# EAGLE schematic GPS_radiologger_v2_energy_harvesting (EAGLE 9.5.1)
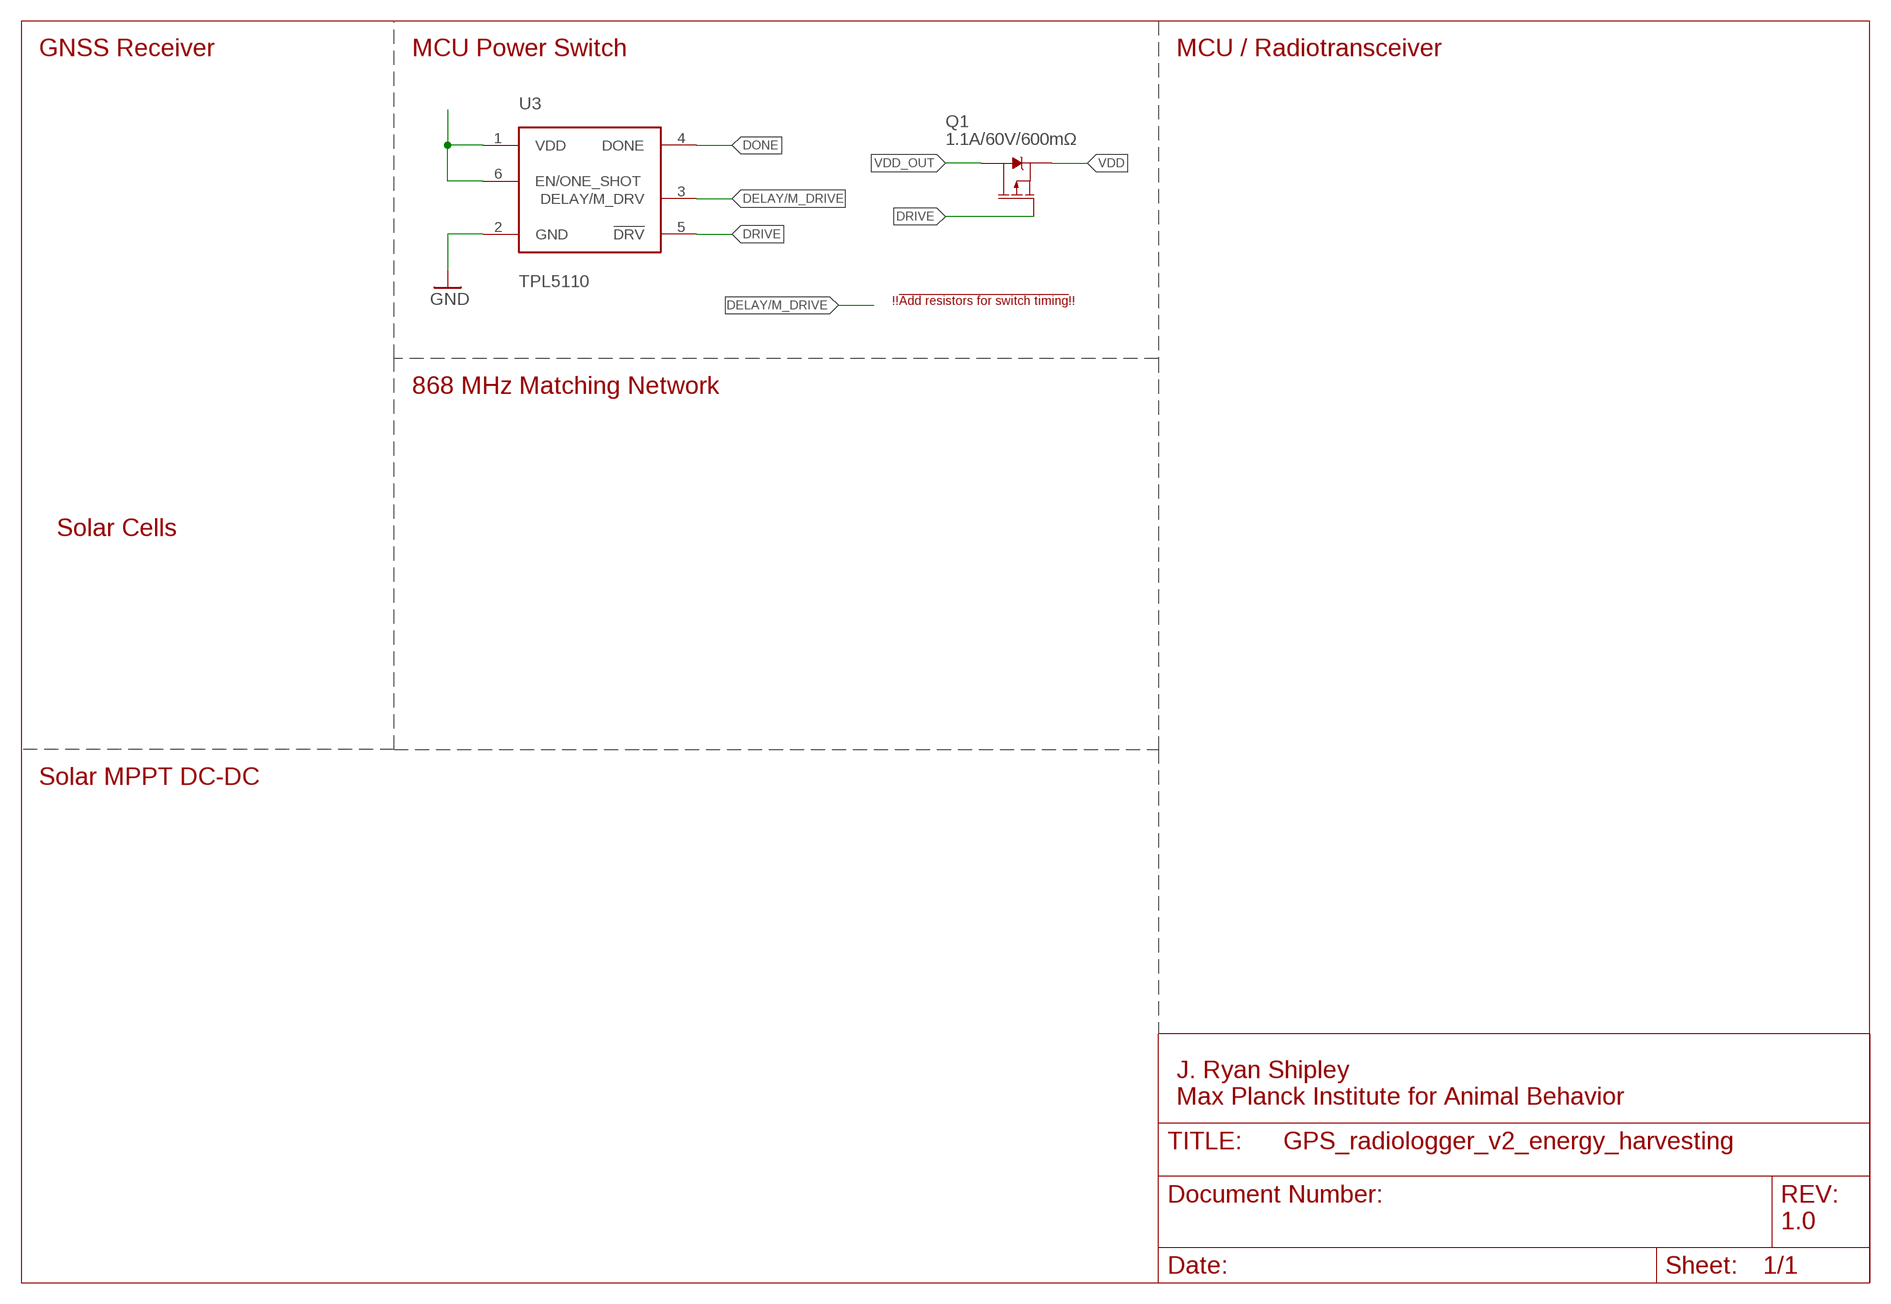
[diagram p0: schematic, sheet 1]

## Parts
Q1  1.1A/60V/600mΩ  MOSFET_PCH-SI2309DS  [SOT23-3]
U3  TPL5110  [SOT23-6]

## Nets
DELAY/M_DRIVE: U3.3(DELAY/M_DRV)
DONE: U3.4(DONE)
DRIVE: Q1.1(G) U3.5(!DRV)
GND: U3.2(GND)
N$6: U3.1(VDD) U3.6(EN/ONE_SHOT)
VDD: Q1.2(S)
VDD_OUT: Q1.3(D)

## Notes on the sheet
- GNSS Receiver | MCU Power Switch | MCU / Radiotransceiver
- !!!Add resistors for switch timing!!!
- 868 MHz Matching Network
- Solar Cells
- Solar MPPT DC-DC
- J. Ryan Shipley
  Max Planck Institute for Animal Behavior
- 1.0

## Library data of the parts
Q1 = SparkFun-DiscreteSemi:MOSFET_PCH: P-channel MOSFETs Voltage controlled devices that allow control of high current outputs. SparkFun Products: SparkFun ESP32 Thing <https://www.sparkfun.com/products/13907> SparkFun ESP8266 Thing <https://www.sparkfun.com/products/13231>; PROD_ID: TRANS-08285
U3 = SparkFun-IC-Power:TPL5110: TPL5110 Nano-Power System Timer for Power Gating The TPL5110 Nano Timer is a low power timer with an integrated MOSFET driver designed for power gating in duty cycled or battery-powered applications. Consuming only 35 nA, the TPL5110 can enable the power supply line and drastically reduce the overall system stand by current during the sleep time.; PROD_ID: IC-14387